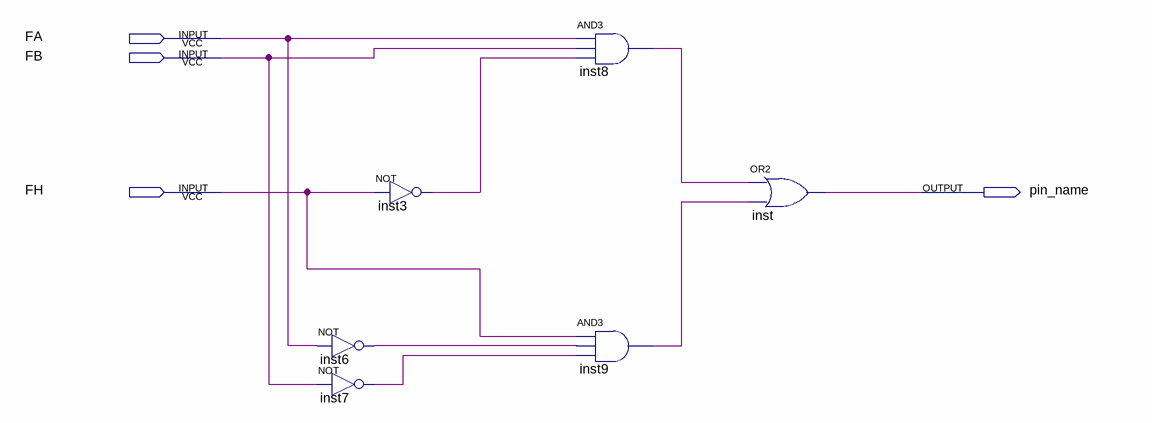
[diagram p0: schematic sheet]
// Quartus schematic PSWV.bdf as structural Verilog: 6 symbols, 4 pins
module PSWV (
  input  FA,
  input  FB,
  input  FH,
  output pin_name
);

  wire inst3_out, inst6_out, inst7_out, inst8_out, inst9_out;

  not inst6 (inst6_out, FA);
  not inst7 (inst7_out, FB);
  not inst3 (inst3_out, FH);
  and inst8 (inst8_out, FA, FB, inst3_out);
  and inst9 (inst9_out, FH, inst6_out, inst7_out);
  or inst (pin_name, inst8_out, inst9_out);
endmodule
